# Altium schematic sheet Sheet.SchDoc: IOElectro LAOS - Main
size A4; Author: -; CompanyName: IOElectro; DrawnBy: Esmaeill M; Engineer: -; Organization: IOElectro; Address1: Bushehr,Iran; Address2: www.ioelectro.ir; DocumentNumber: 1; Revision: v0.1; SheetNumber: 1; SheetTotal: 4; ProjectNumber: 1013; Note: Main Board
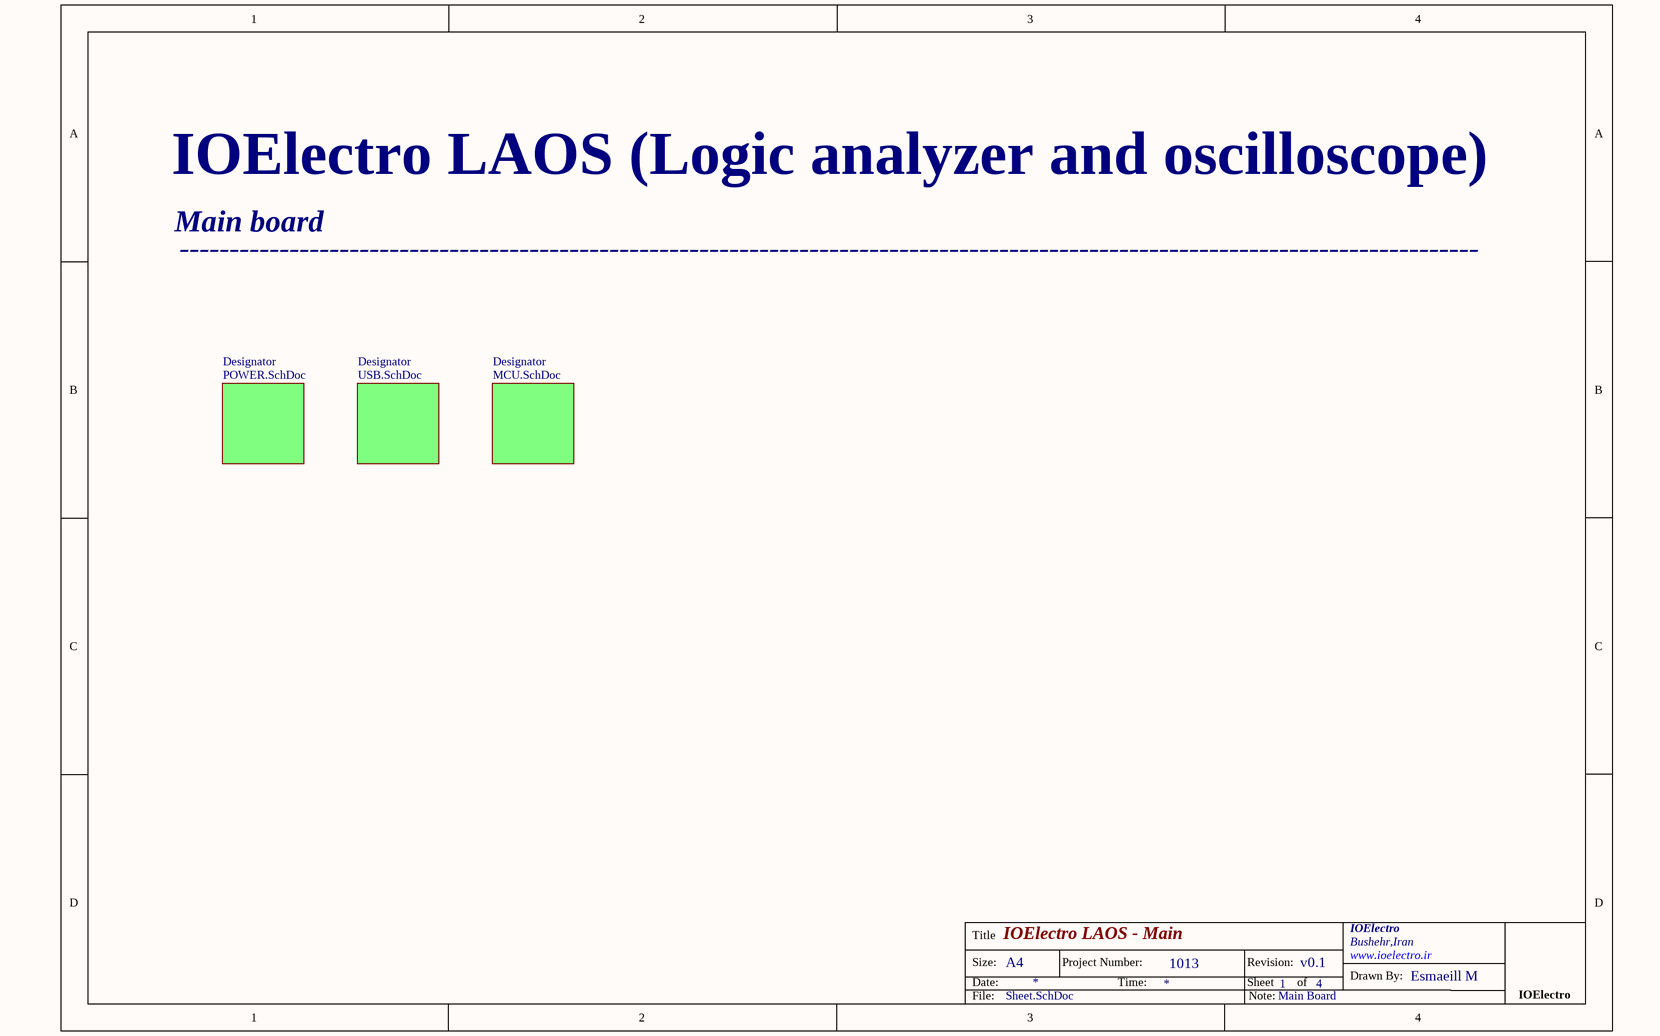
[diagram p0: Sheet.SchDoc]

## Sub-sheets
Designator = POWER.SchDoc: no entries
Designator = USB.SchDoc: no entries
Designator = MCU.SchDoc: no entries

## Notes on the sheet
- IOElectro LAOS (Logic analyzer and oscilloscope)
- Main board
- ----------------------------------------------------------------------------------------------------------------------------------
- Title
- Size:
- Date:
- A4
- Project Number:
- Time:
- Revision:
- Sheet
- of
- Drawn By:
- IOElectro
- File:
- Note: